# EAGLE design carrier (EAGLE 6.2)
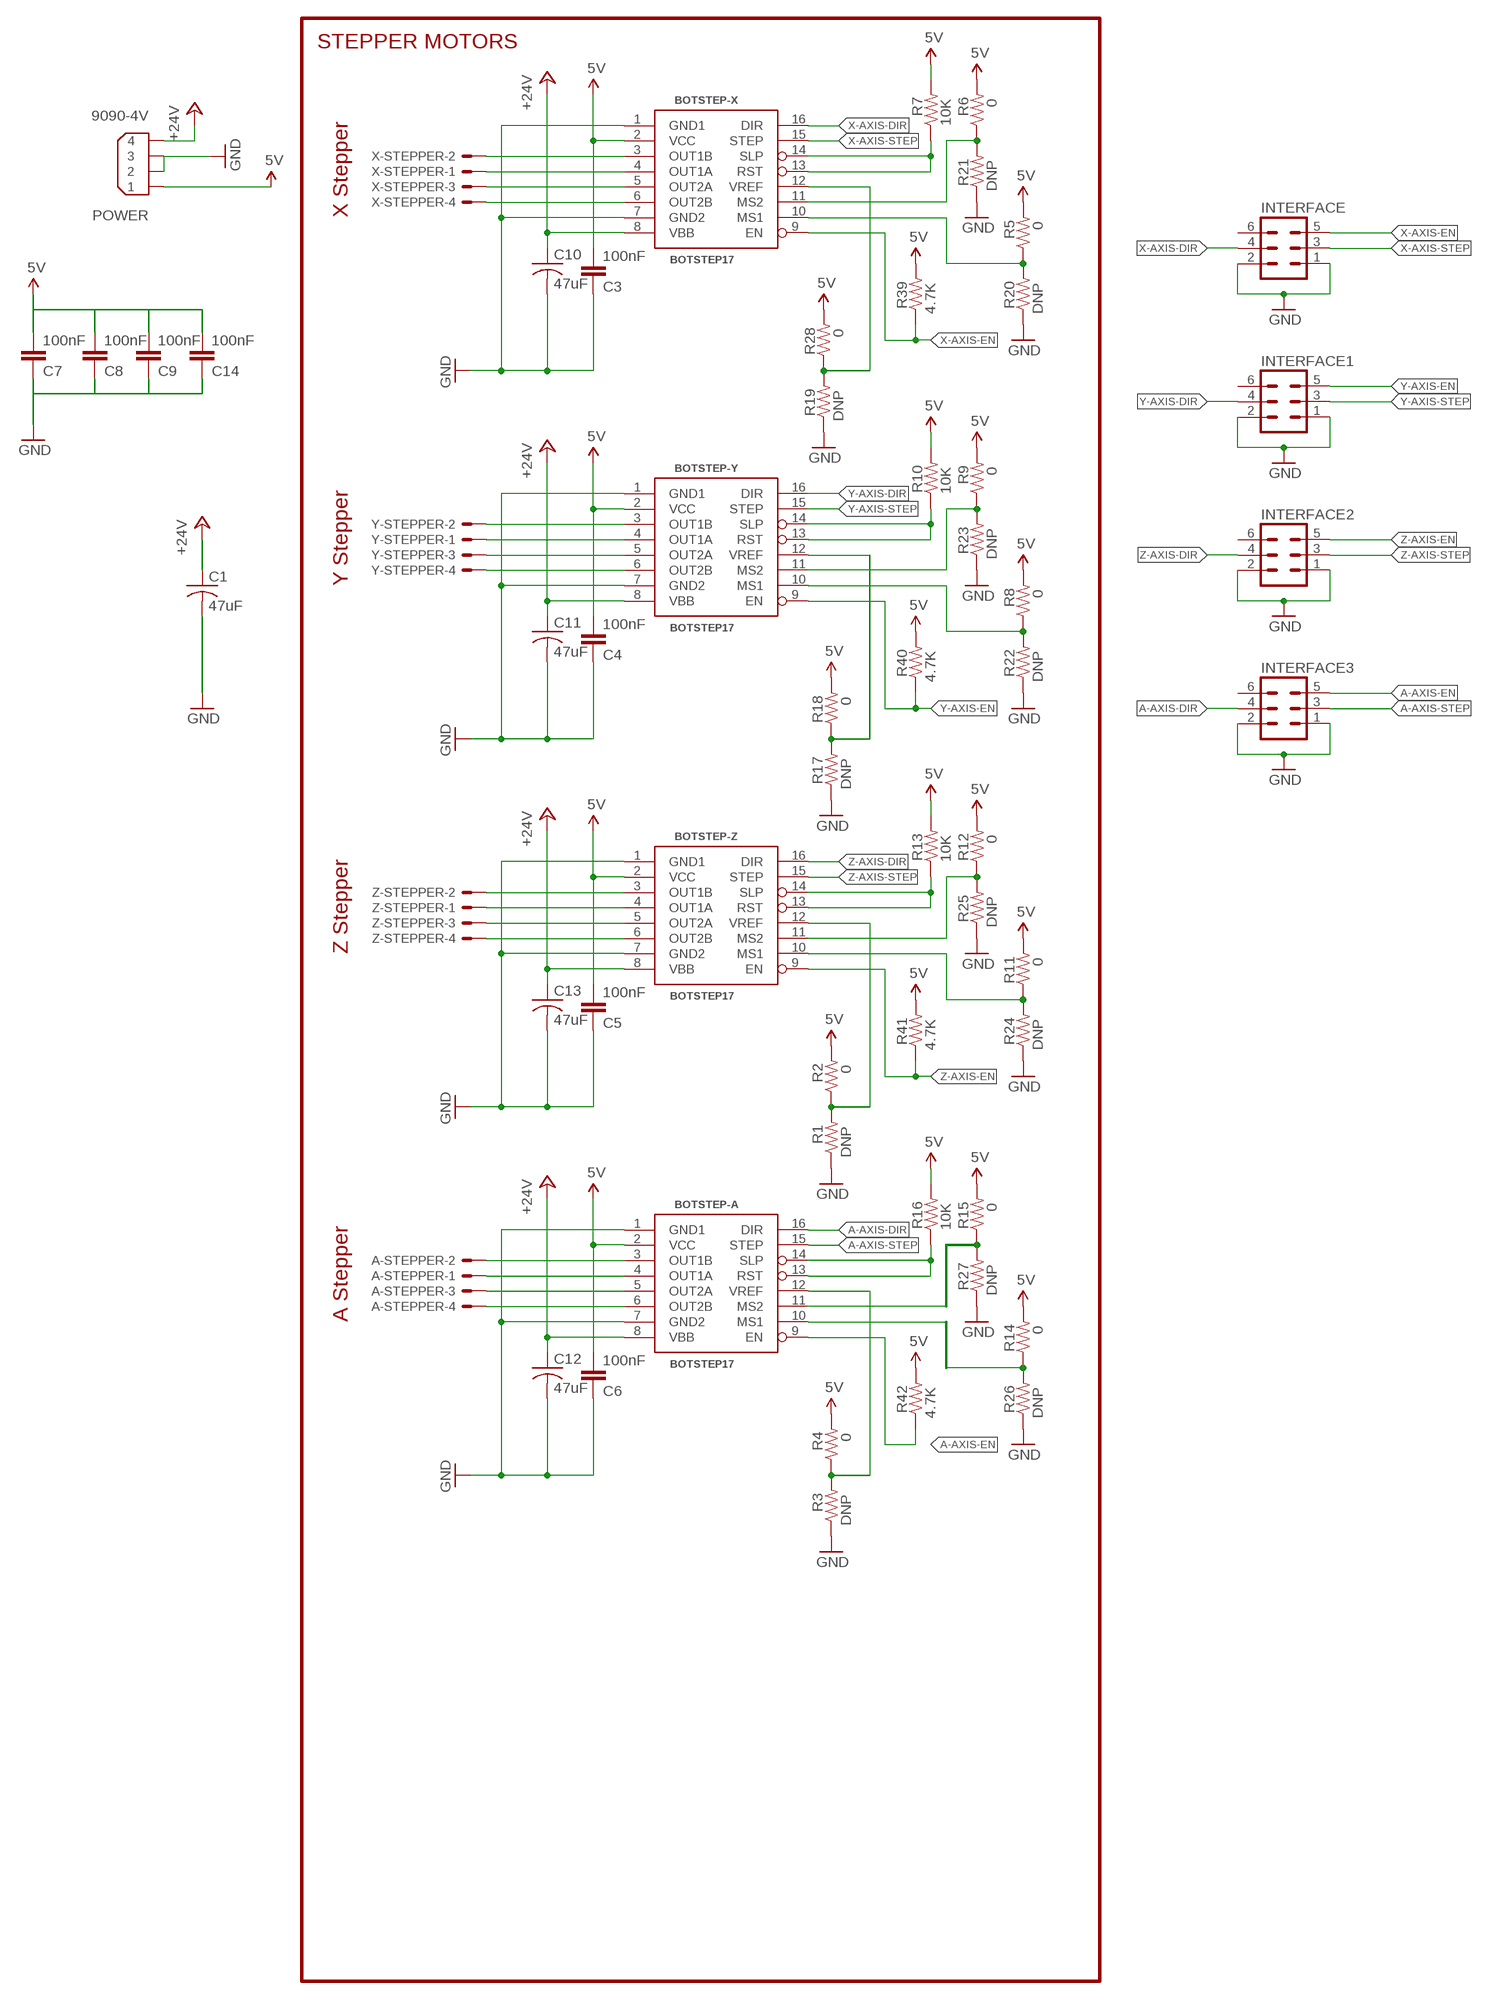
[diagram p0: schematic, sheet 1]

## Parts
A-STEPPER  KK-156-4  [KK-156-4]
BOTSTEP-A  BOTSTEP17  BOTSTEP17CHIP-DOWN  [BOTSTEP17-INV]
BOTSTEP-X  BOTSTEP17  BOTSTEP17CHIP-DOWN  [BOTSTEP17-INV]
BOTSTEP-Y  BOTSTEP17  BOTSTEP17CHIP-DOWN  [BOTSTEP17-INV]
BOTSTEP-Z  BOTSTEP17  BOTSTEP17CHIP-DOWN  [BOTSTEP17-INV]
C1  47uF  C-US050-075X075  [C050-075X075]
C3  100nF  CAPPTH1  [CAP-PTH-5MM]
C4  100nF  CAPPTH1  [CAP-PTH-5MM]
C5  100nF  CAPPTH1  [CAP-PTH-5MM]
C6  100nF  CAPPTH1  [CAP-PTH-5MM]
C7  100nF  CAPPTH1  [CAP-PTH-5MM]
C8  100nF  CAPPTH1  [CAP-PTH-5MM]
C9  100nF  CAPPTH1  [CAP-PTH-5MM]
C10  47uF  C-US050-075X075  [C050-075X075]
C11  47uF  C-US050-075X075  [C050-075X075]
C12  47uF  C-US050-075X075  [C050-075X075]
C13  47uF  C-US050-075X075  [C050-075X075]
C14  100nF  CAPPTH1  [CAP-PTH-5MM]
INTERFACE  ML6  [ML6]
INTERFACE1  ML6  [ML6]
INTERFACE2  ML6  [ML6]
INTERFACE3  ML6  [ML6]
POWER  9090-4V  [9090-4V]
R1  DNP  RESISTORPTH1  [AXIAL-0.3]
R2  0  RESISTORPTH1  [AXIAL-0.3]
R3  DNP  RESISTORPTH1  [AXIAL-0.3]
R4  0  RESISTORPTH1  [AXIAL-0.3]
R5  0  RESISTORPTH1  [AXIAL-0.3]
R6  0  RESISTORPTH1  [AXIAL-0.3]
R7  10K  RESISTORPTH1  [AXIAL-0.3]
R8  0  RESISTORPTH1  [AXIAL-0.3]
R9  0  RESISTORPTH1  [AXIAL-0.3]
R10  10K  RESISTORPTH1  [AXIAL-0.3]
R11  0  RESISTORPTH1  [AXIAL-0.3]
R12  0  RESISTORPTH1  [AXIAL-0.3]
R13  10K  RESISTORPTH1  [AXIAL-0.3]
R14  0  RESISTORPTH1  [AXIAL-0.3]
R15  0  RESISTORPTH1  [AXIAL-0.3]
R16  10K  RESISTORPTH1  [AXIAL-0.3]
R17  DNP  RESISTORPTH1  [AXIAL-0.3]
R18  0  RESISTORPTH1  [AXIAL-0.3]
R19  DNP  RESISTORPTH1  [AXIAL-0.3]
R20  DNP  RESISTORPTH1  [AXIAL-0.3]
R21  DNP  RESISTORPTH1  [AXIAL-0.3]
R22  DNP  RESISTORPTH1  [AXIAL-0.3]
R23  DNP  RESISTORPTH1  [AXIAL-0.3]
R24  DNP  RESISTORPTH1  [AXIAL-0.3]
R25  DNP  RESISTORPTH1  [AXIAL-0.3]
R26  DNP  RESISTORPTH1  [AXIAL-0.3]
R27  DNP  RESISTORPTH1  [AXIAL-0.3]
R28  0  RESISTORPTH1  [AXIAL-0.3]
R39  4.7K  RESISTORPTH1  [AXIAL-0.3]
R40  4.7K  RESISTORPTH1  [AXIAL-0.3]
R41  4.7K  RESISTORPTH1  [AXIAL-0.3]
R42  4.7K  RESISTORPTH1  [AXIAL-0.3]
X-STEPPER  KK-156-4  [KK-156-4]
Y-STEPPER  KK-156-4  [KK-156-4]
Z-STEPPER  KK-156-4  [KK-156-4]

## Nets
5V [5V]: BOTSTEP-A.2(VCC) BOTSTEP-X.2(VCC) BOTSTEP-Y.2(VCC) BOTSTEP-Z.2(VCC) C3.2 C4.2 C5.2 C6.2 C7.2 C8.2 C9.2 C14.2 POWER.1 R2.P$2 R4.P$2 R5.P$2 R6.P$2 R7.P$2 R8.P$2 R9.P$2 R10.P$2 R11.P$2 R12.P$2 R13.P$2 R14.P$2 R15.P$2 R16.P$2 R18.P$2 R28.P$2 R39.P$2 R40.P$2 R41.P$2 R42.P$2
+24V [24V]: BOTSTEP-A.8(VBB) BOTSTEP-X.8(VBB) BOTSTEP-Y.8(VBB) BOTSTEP-Z.8(VBB) C1.1 C10.1 C11.1 C12.1 C13.1 POWER.4
A-AXIS-DIR: BOTSTEP-A.16(DIR) INTERFACE3.4
A-AXIS-EN: BOTSTEP-A.9(EN) INTERFACE3.5 R42.P$1
A-AXIS-STEP: BOTSTEP-A.15(STEP) INTERFACE3.3
GND [gnd]: BOTSTEP-A.1(GND1) BOTSTEP-A.7(GND2) BOTSTEP-X.1(GND1) BOTSTEP-X.7(GND2) BOTSTEP-Y.1(GND1) BOTSTEP-Y.7(GND2) BOTSTEP-Z.1(GND1) BOTSTEP-Z.7(GND2) C1.2 C3.1 C4.1 C5.1 C6.1 C7.1 C8.1 C9.1 C10.2 C11.2 C12.2 C13.2 C14.1 INTERFACE1.1 INTERFACE1.2 INTERFACE2.1 INTERFACE2.2 INTERFACE3.1 INTERFACE3.2 INTERFACE.1 INTERFACE.2 POWER.2 POWER.3 R1.P$1 R3.P$1 R17.P$1 R19.P$1 R20.P$1 R21.P$1 R22.P$1 R23.P$1 R24.P$1 R25.P$1 R26.P$1 R27.P$1
N$18: BOTSTEP-X.10(MS1) R5.P$1 R20.P$2
N$37: BOTSTEP-X.13(RST) BOTSTEP-X.14(SLP) R7.P$1
N$96: BOTSTEP-X.12(VREF) R19.P$2 R28.P$1
N$100: BOTSTEP-X.11(MS2) R6.P$1 R21.P$2
N$102: BOTSTEP-Y.13(RST) BOTSTEP-Y.14(SLP) R10.P$1
N$104: BOTSTEP-X.3(OUT1B) X-STEPPER.2
N$105: BOTSTEP-X.4(OUT1A) X-STEPPER.1
N$106: BOTSTEP-X.5(OUT2A) X-STEPPER.3
N$107: BOTSTEP-X.6(OUT2B) X-STEPPER.4
N$111: BOTSTEP-Y.12(VREF) R17.P$2 R18.P$1
N$114: BOTSTEP-Y.11(MS2) R9.P$1 R23.P$2
N$115: BOTSTEP-Y.3(OUT1B) Y-STEPPER.2
N$117: BOTSTEP-Y.4(OUT1A) Y-STEPPER.1
N$118: BOTSTEP-Y.5(OUT2A) Y-STEPPER.3
N$120: BOTSTEP-Y.6(OUT2B) Y-STEPPER.4
N$121: BOTSTEP-Y.10(MS1) R8.P$1 R22.P$2
N$122: BOTSTEP-Z.13(RST) BOTSTEP-Z.14(SLP) R13.P$1
N$124: BOTSTEP-Z.12(VREF) R1.P$2 R2.P$1
N$161: BOTSTEP-Z.11(MS2) R12.P$1 R25.P$2
N$162: BOTSTEP-Z.3(OUT1B) Z-STEPPER.2
N$163: BOTSTEP-Z.4(OUT1A) Z-STEPPER.1
N$164: BOTSTEP-Z.5(OUT2A) Z-STEPPER.3
N$165: BOTSTEP-Z.6(OUT2B) Z-STEPPER.4
N$166: BOTSTEP-Z.10(MS1) R11.P$1 R24.P$2
N$172: BOTSTEP-A.13(RST) BOTSTEP-A.14(SLP) R16.P$1
N$173: BOTSTEP-A.12(VREF) R3.P$2 R4.P$1
N$177: BOTSTEP-A.11(MS2) R15.P$1 R27.P$2
N$179: A-STEPPER.2 BOTSTEP-A.3(OUT1B)
N$182: A-STEPPER.1 BOTSTEP-A.4(OUT1A)
N$183: A-STEPPER.3 BOTSTEP-A.5(OUT2A)
N$185: A-STEPPER.4 BOTSTEP-A.6(OUT2B)
N$188: BOTSTEP-A.10(MS1) R14.P$1 R26.P$2
X-AXIS-DIR: BOTSTEP-X.16(DIR) INTERFACE.4
X-AXIS-EN: BOTSTEP-X.9(EN) INTERFACE.5 R39.P$1
X-AXIS-STEP: BOTSTEP-X.15(STEP) INTERFACE.3
Y-AXIS-DIR: BOTSTEP-Y.16(DIR) INTERFACE1.4
Y-AXIS-EN: BOTSTEP-Y.9(EN) INTERFACE1.5 R40.P$1
Y-AXIS-STEP: BOTSTEP-Y.15(STEP) INTERFACE1.3
Z-AXIS-DIR: BOTSTEP-Z.16(DIR) INTERFACE2.4
Z-AXIS-EN: BOTSTEP-Z.9(EN) INTERFACE2.5 R41.P$1
Z-AXIS-STEP: BOTSTEP-Z.15(STEP) INTERFACE2.3
Unconnected: INTERFACE1.6 INTERFACE2.6 INTERFACE3.6 INTERFACE.6

## Notes on the sheet
- STEPPER MOTORS
- X Stepper
- Y Stepper
- Z Stepper
- A Stepper

## Library data of the parts
A-STEPPER X-STEPPER Y-STEPPER Z-STEPPER = con-molex:KK-156-4: KK 156 HEADER Source: http://www.molex.com/pdm_docs/sd/026604100_sd.pdf; OC_FARNELL: unknown; OC_NEWARK: unknown
BOTSTEP-A BOTSTEP-X BOTSTEP-Y BOTSTEP-Z = MakerBot:BOTSTEP17
C1 C10-C13 = adafruit:C-US: CAPACITOR, American symbol
C3-C9 C14 = SparkFun:CAP: Capacitor Standard 0603 ceramic capacitor, and 0.1" leaded capacitor.
INTERFACE INTERFACE1-INTERFACE3 = con-ml:ML6: HARTING
POWER = con-thomas-betts:9090-4: Disk Drive Power four position Source: Thomas & Betts Electronic Interconnects Eiropean Edition 1998
R1-R28 R39-R42 = SparkFun:RESISTOR: Resistor Basic schematic elements and footprints for 0603, 1206, and PTH 1/10th watt (small) resistors.

## Net classes
0 default: width 0.203 mm, drill 0.508 mm, clearance 0.203 mm
1 24V: width 0.889 mm, drill 0.635 mm, clearance 0.508 mm
2 gnd: width 0.381 mm, drill 0.508 mm, clearance 0.254 mm
3 5V: width 0.381 mm, drill 0.508 mm, clearance 0.254 mm

## Board
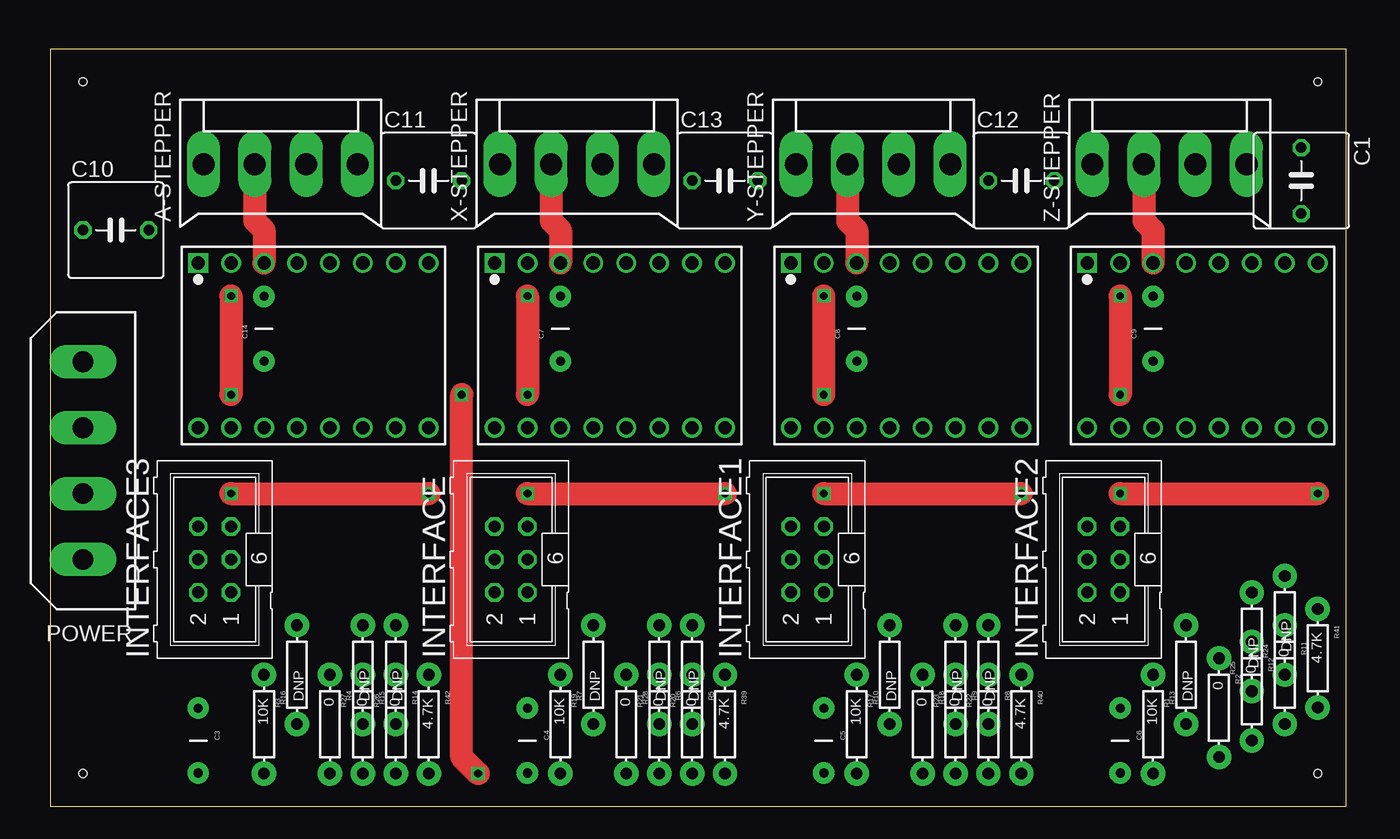
[diagram p1: board, top side]
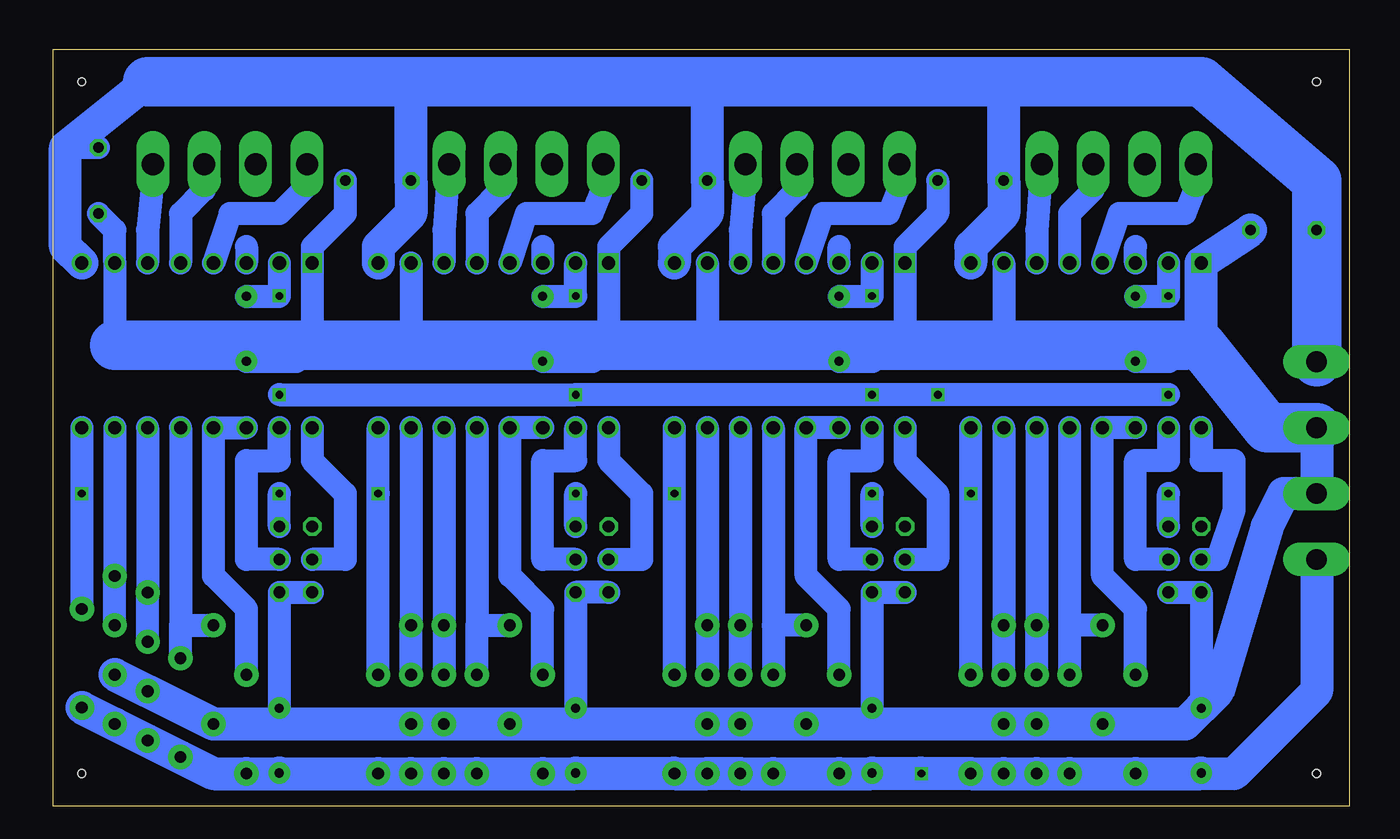
[diagram p2: board, bottom side, seen from below]

Size 100 x 58.41 mm. Coordinates in mm from the lower left corner, seen from the top.
Outline: 0,0 100,0 100,58.41 0,58.41 0,0
Copper layers (1*16): Top 0.035mm / dielectric 1.5mm / Bottom 0.035mm
Design rules: minimum track width 10mil, minimum drill 24mil, track to track 8mil, track to pad 8mil, pad to pad 8mil, via to via 8mil, smd to smd 8mil, copper to edge 40mil, drill to drill 8mil, minimum pad ring 10mil, minimum via ring 8mil, stop-mask expansion 4mil, vias tented up to drill 0mil, thermal gap 10mil
Holes 0.6 mm at 2.54,2.54 2.54,55.88 97.79,55.88 97.79,55.88 97.79,2.54

### Footprints (pad centres in the part's own frame; a part is rotated, then mirrored left to right if it is on the bottom)
KK-156-4 = drill 1.7 pad 2.184 long: 1 -5.94,0; 2 -1.98,0; 3 1.98,0; 4 5.94,0
BOTSTEP17-INV = drill 1.016 square: 1 6.35,8.89 | drill 1.016: 2 6.35,6.35; 3 6.35,3.81; 4 6.35,1.27; 5 6.35,-1.27; 6 6.35,-3.81; 7 6.35,-6.35; 8 6.35,-8.89; 9 -6.35,-8.89; 10 -6.35,-6.35; 11 -6.35,-3.81; 12 -6.35,-1.27; 13 -6.35,1.27; 14 -6.35,3.81; 15 -6.35,6.35; 16 -6.35,8.89
C050-075X075 = drill 0.813 octagon: 1 -2.54,0; 2 2.54,0
CAP-PTH-5MM = drill 0.7 pad 1.651: 1 -2.5,0; 2 2.5,0
ML6 = drill 0.914 octagon: 1 -2.54,-1.27; 2 -2.54,1.27; 3 0,-1.27; 4 0,1.27; 5 2.54,-1.27; 6 2.54,1.27
9090-4V = drill 1.6 pad 2.6 long: 1 -7.62,0; 2 -2.54,0; 3 2.54,0; 4 7.62,0
AXIAL-0.3 = drill 0.9 pad 1.88: P$1 -3.81,0; P$2 3.81,0

### Placement (x,y rotation side)
A-STEPPER  17.78,49.53 0 top
BOTSTEP-A  20.32,35.56 90 top
BOTSTEP-X  43.18,35.56 90 top
BOTSTEP-Y  66.04,35.56 90 top
BOTSTEP-Z  88.9,35.56 90 top
C1  96.52,48.26 270 top
C3  11.43,5.08 270 top
C4  36.83,5.08 270 top
C5  59.69,5.08 270 top
C6  82.55,5.08 270 top
C7  39.37,36.83 90 top
C8  62.23,36.83 90 top
C9  85.09,36.83 90 top
C10  5.08,44.45 0 top
C11  29.21,48.26 0 top
C12  74.93,48.26 0 top
C13  52.07,48.26 0 top
C14  16.51,36.83 90 top
INTERFACE  35.56,19.05 90 top
INTERFACE1  58.42,19.05 90 top
INTERFACE2  81.28,19.05 90 top
INTERFACE3  12.7,19.05 90 top
POWER  2.54,26.67 90 top
R1  87.63,10.16 90 top
R2  90.17,7.62 270 top
R3  19.05,10.16 90 top
R4  21.59,6.35 270 top
R5  49.53,6.35 270 top
R6  46.99,6.35 270 top
R7  39.37,6.35 270 top
R8  72.39,6.35 270 top
R9  69.85,6.35 270 top
R10  62.23,6.35 270 top
R11  95.25,10.16 270 top
R12  92.71,8.89 270 top
R13  85.09,6.35 270 top
R14  26.67,6.35 270 top
R15  24.13,6.35 270 top
R16  16.51,6.35 270 top
R17  64.77,10.16 90 top
R18  67.31,6.35 270 top
R19  41.91,10.16 90 top
R20  49.53,10.16 90 top
R21  46.99,10.16 90 top
R22  72.39,10.16 90 top
R23  69.85,10.16 90 top
R24  95.25,13.97 90 top
R25  92.71,12.7 90 top
R26  26.67,10.16 90 top
R27  24.13,10.16 90 top
R28  44.45,6.35 270 top
R39  52.07,6.35 270 top
R40  74.93,6.35 270 top
R41  97.79,11.43 270 top
R42  29.21,6.35 270 top
X-STEPPER  40.64,49.53 0 top
Y-STEPPER  63.5,49.53 0 top
Z-STEPPER  86.36,49.53 0 top

### Tracks (layer width: path | path; a pad name or v marks a point on that pad's centre or on a via)
5V  (via drill 0.6)
  Top 1.778: v82.55,39.37 v82.55,31.75 | v59.69,31.75 v59.69,39.37 | v36.83,39.37 v36.83,31.75 | v13.97,39.37 v13.97,31.75 | v33.02,2.54 31.75,3.81 v31.75,31.75
  Bottom 1.778: BOTSTEP-Z.2 v82.55,39.37 82.59,39.33 C9.2 | v82.55,31.75 v59.69,31.75 v36.83,31.75 v31.75,31.75 v13.97,31.75 | BOTSTEP-Y.2 v59.69,39.37 59.73,39.33 C8.2 | BOTSTEP-X.2 v36.83,39.37 36.87,39.33 C7.2 | BOTSTEP-A.2 v13.97,39.37 14.01,39.33 C14.2
  Bottom 2.54: POWER.1 2.54,8.89 8.89,2.54 11.47,2.58 C3.2 11.47,2.54 R16.P$2 R4.P$2 R15.P$2 R14.P$2 R42.P$2 v33.02,2.54 33.06,2.58 C4.2 36.87,2.54 R7.P$2 R28.P$2 R6.P$2 R5.P$2 R39.P$2 52.11,2.58 C5.2 59.73,2.54 R10.P$2 R18.P$2 R9.P$2 R8.P$2 R40.P$2 82.59,2.54 | R41.P$2 R11.P$2 R12.P$2 R2.P$2 87.63,2.54 R13.P$2 82.59,2.54 | 82.59,2.54 C6.2
+24V
  Bottom 1.778: C1.1 99.06,50.8
  Bottom 2.54: 26.67,55.88 C11.1 26.67,45.72 29.21,43.18 BOTSTEP-A.8 | 49.53,55.88 C13.1 49.53,45.72 52.07,43.18 BOTSTEP-X.8 | 72.39,55.88 C12.1 72.39,45.72 74.93,43.18 BOTSTEP-Y.8 | BOTSTEP-Z.8 99.06,43.18 99.06,50.8 92.71,55.88
  Bottom 3.81: 92.71,55.88 72.39,55.88 49.53,55.88 26.67,55.88 11.43,55.88 2.54,48.26 C10.1 POWER.4
A-AXIS-DIR
  Bottom 1.778: BOTSTEP-A.16 11.43,26.67 8.89,26.67 8.89,22.86 10.16,19.05 INTERFACE3.4
A-AXIS-EN  (via drill 0.6)
  Top 1.778: v13.97,24.13 v29.21,24.13
  Bottom 1.778: R42.P$1 v29.21,24.13 BOTSTEP-A.9 | INTERFACE3.5 v13.97,24.13
A-AXIS-STEP
  Bottom 1.778: INTERFACE3.3 16.51,19.05 16.51,26.67 13.97,26.67 BOTSTEP-A.15
GND
  Bottom 1.778: 95.25,35.56 BOTSTEP-Z.7 95.25,44.45 C1.2 | BOTSTEP-Y.7 72.39,35.56 | BOTSTEP-A.7 26.67,35.56 | BOTSTEP-X.7 49.53,35.56 | C11.2 31.75,45.72 34.29,43.18 BOTSTEP-X.1 34.29,36.83 | 34.29,36.83 34.29,35.56 | C13.2 54.61,45.72 57.15,43.18 BOTSTEP-Y.1 57.15,35.56 58.38,34.33 C8.1 | C12.2 77.47,45.72 80.01,43.18 BOTSTEP-Z.1 80.01,35.56 81.24,34.33 C9.1 | 11.43,35.56 12.7,35.56 | INTERFACE2.2 INTERFACE2.1 C6.1 82.55,6.35 | INTERFACE1.2 INTERFACE1.1 C5.1 59.69,6.35 | INTERFACE.2 INTERFACE.1 C4.1 36.83,6.35 | INTERFACE3.1 INTERFACE3.2 C3.1 | C7.1 36.79,34.33 34.29,36.83 | C14.1 13.93,34.33 11.43,36.83
  Bottom 2.54: POWER.3 POWER.2 5.08,24.13 6.35,21.59 10.16,8.85 C3.1 11.47,7.58 12.7,6.35 R3.P$1 R27.P$1 R26.P$1 36.83,6.35 R19.P$1 R21.P$1 R20.P$1 59.69,6.35 R17.P$1 R23.P$1 R22.P$1 82.55,6.35 R1.P$1 R25.P$1 R24.P$1 | 11.43,35.56 11.43,36.83 BOTSTEP-A.1 C10.2
  Bottom 3.81: POWER.3 6.35,29.21 11.43,35.56 | 95.25,35.56 80.01,35.56 72.39,35.56 57.15,35.56 49.53,35.56 34.29,35.56 26.67,35.56 12.7,35.56
N$18
  Bottom 1.778: BOTSTEP-X.10 R20.P$2 R5.P$1
N$37
  Bottom 1.778: R7.P$1 39.37,15.24 41.91,17.78 BOTSTEP-X.13 BOTSTEP-X.14
N$96
  Bottom 1.778: R19.P$2 44.45,13.97 | 44.45,13.97 R28.P$1 | BOTSTEP-X.12 44.45,13.97
N$100
  Bottom 1.778: R6.P$1 R21.P$2 BOTSTEP-X.11
N$102
  Bottom 1.778: BOTSTEP-Y.14 BOTSTEP-Y.13 64.77,17.78 62.23,15.24 R10.P$1
N$104
  Top 1.778: X-STEPPER.2 38.66,45.16 39.37,44.45 BOTSTEP-X.3
  Bottom 1.778: BOTSTEP-X.3 39.37,43.18
N$105
  Bottom 1.778: X-STEPPER.1 34.7,47.85 35.56,45.72 40.64,45.72 BOTSTEP-X.4
N$106
  Bottom 1.778: X-STEPPER.3 42.62,47.55 44.45,45.72 BOTSTEP-X.5
N$107
  Bottom 1.778: X-STEPPER.4 46.58,48.67 46.99,44.45 BOTSTEP-X.6
N$111
  Bottom 1.778: R18.P$1 67.31,13.97 | 67.31,13.97 R17.P$2 | BOTSTEP-Y.12 67.31,13.97
N$114
  Bottom 1.778: R9.P$1 R23.P$2 BOTSTEP-Y.11
N$115
  Top 1.778: Y-STEPPER.2 61.52,45.16 62.23,44.45 BOTSTEP-Y.3
  Bottom 1.778: 62.23,43.18 BOTSTEP-Y.3
N$117
  Bottom 1.778: Y-STEPPER.1 57.56,47.85 58.42,45.72 63.5,45.72 BOTSTEP-Y.4
N$118
  Bottom 1.778: Y-STEPPER.3 65.48,47.55 67.31,45.72 BOTSTEP-Y.5
N$120
  Bottom 1.778: Y-STEPPER.4 69.44,49.94 69.85,44.45 BOTSTEP-Y.6
N$121
  Bottom 1.778: BOTSTEP-Y.10 R22.P$2 R8.P$1
N$122
  Bottom 1.778: BOTSTEP-Z.14 BOTSTEP-Z.13 87.63,17.78 85.09,15.24 R13.P$1
N$124
  Bottom 1.778: R2.P$1 90.17,13.97 | 90.17,13.97 R1.P$2 | BOTSTEP-Z.12 90.17,13.97
N$161
  Bottom 1.778: R12.P$1 R25.P$2 BOTSTEP-Z.11
N$162
  Top 1.778: Z-STEPPER.2 84.38,45.16 85.09,44.45 BOTSTEP-Z.3
  Bottom 1.778: 85.09,43.18 BOTSTEP-Z.3
N$163
  Bottom 1.778: Z-STEPPER.1 80.42,47.85 82.55,45.72 86.36,45.72 BOTSTEP-Z.4
N$164
  Bottom 1.778: Z-STEPPER.3 88.34,47.55 90.17,45.72 BOTSTEP-Z.5
N$165
  Bottom 1.778: Z-STEPPER.4 92.3,48.67 92.71,44.45 BOTSTEP-Z.6
N$166
  Bottom 1.778: BOTSTEP-Z.10 R24.P$2 R11.P$1
N$172
  Bottom 1.778: R16.P$1 16.51,15.24 19.05,17.78 BOTSTEP-A.13 BOTSTEP-A.14
N$173
  Bottom 1.778: R3.P$2 21.59,13.97 | 21.59,13.97 R4.P$1 | BOTSTEP-A.12 21.59,13.97
N$177
  Bottom 1.778: R15.P$1 R27.P$2 BOTSTEP-A.11
N$179
  Top 1.778: A-STEPPER.2 15.8,45.16 16.51,44.45 BOTSTEP-A.3
  Bottom 1.778: BOTSTEP-A.3 16.51,43.18
N$182
  Bottom 1.778: A-STEPPER.1 11.84,47.85 12.7,45.72 17.78,45.72 BOTSTEP-A.4
N$183
  Bottom 1.778: A-STEPPER.3 19.76,47.55 21.59,45.72 BOTSTEP-A.5
N$185
  Bottom 1.778: A-STEPPER.4 23.72,49.94 24.13,44.45 BOTSTEP-A.6
N$188
  Bottom 1.778: BOTSTEP-A.10 R26.P$2 R14.P$1
X-AXIS-DIR
  Bottom 1.778: INTERFACE.4 31.75,19.05 31.75,24.13 34.29,26.67 BOTSTEP-X.16
X-AXIS-EN  (via drill 0.6)
  Top 1.778: v36.83,24.13 v52.07,24.13
  Bottom 1.778: R39.P$1 v52.07,24.13 BOTSTEP-X.9 | INTERFACE.5 v36.83,24.13
X-AXIS-STEP
  Bottom 1.778: INTERFACE.3 39.37,19.05 39.37,26.67 36.83,26.67 BOTSTEP-X.15
Y-AXIS-DIR
  Bottom 1.778: INTERFACE1.4 54.61,19.05 54.61,24.13 57.15,26.67 BOTSTEP-Y.16
Y-AXIS-EN  (via drill 0.6)
  Top 1.778: v59.69,24.13 v74.93,24.13
  Bottom 1.778: R40.P$1 v74.93,24.13 BOTSTEP-Y.9 | INTERFACE1.5 v59.69,24.13
Y-AXIS-STEP
  Bottom 1.778: INTERFACE1.3 62.23,19.05 62.23,26.67 59.69,26.67 BOTSTEP-Y.15
Z-AXIS-DIR
  Bottom 1.778: BOTSTEP-Z.16 80.01,26.67 77.47,24.13 77.47,19.05 INTERFACE2.4
Z-AXIS-EN  (via drill 0.6)
  Top 1.778: v82.55,24.13 v97.79,24.13
  Bottom 1.778: INTERFACE2.5 v82.55,24.13 | R41.P$1 v97.79,24.13 BOTSTEP-Z.9
Z-AXIS-STEP
  Bottom 1.778: INTERFACE2.3 85.09,19.05 85.09,26.67 82.55,26.67 BOTSTEP-Z.15